# EAGLE schematic lemon-drop (EAGLE 9.6.2)
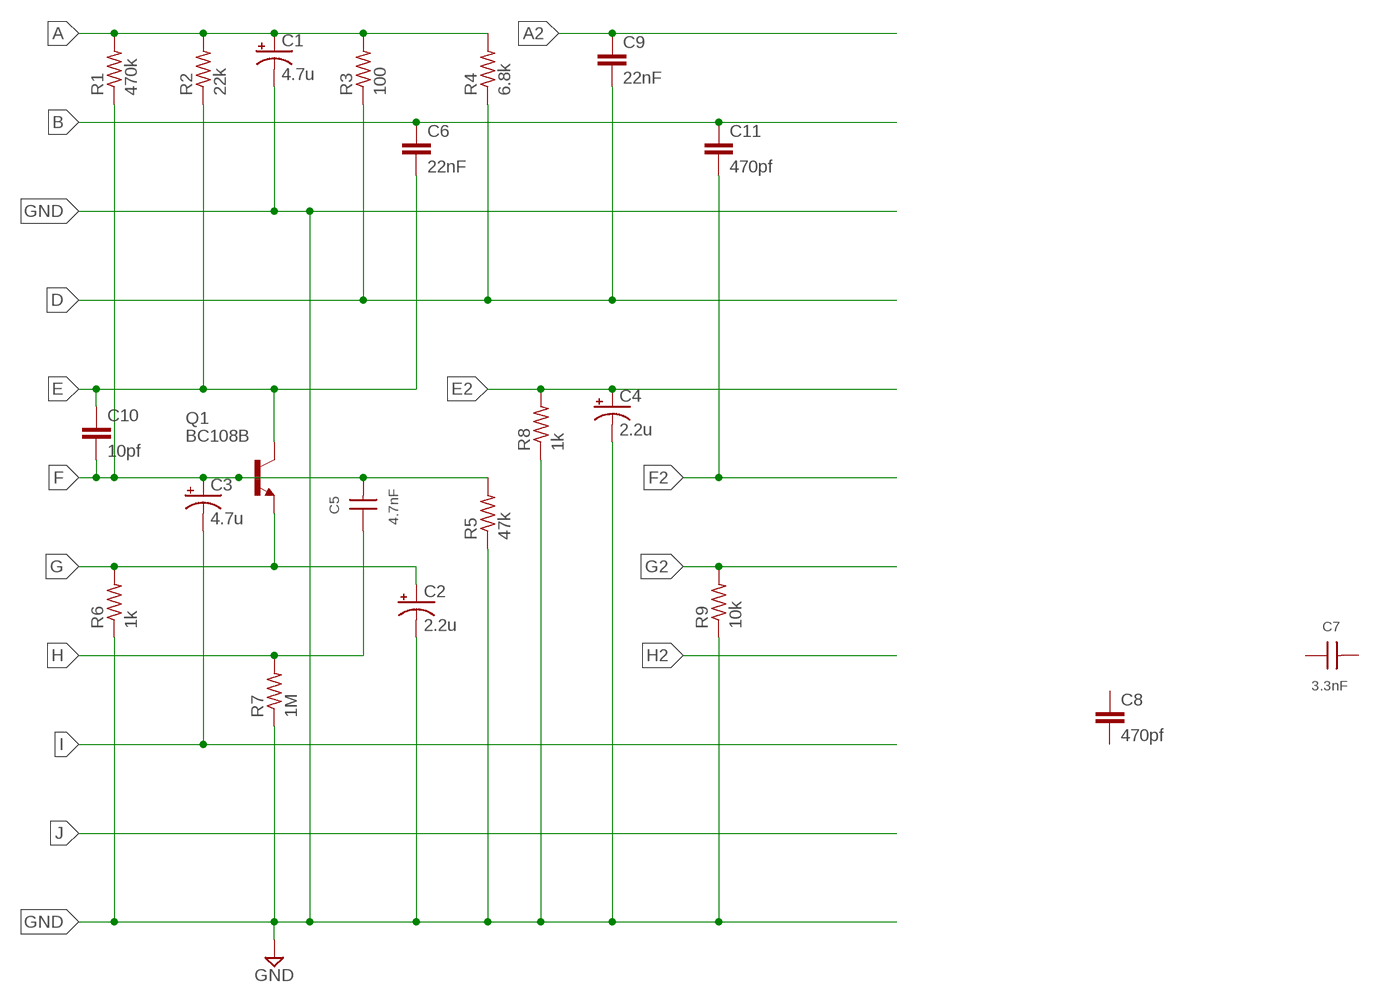
[diagram p0: schematic, sheet 1]

## Parts
C1  4.7u  C-E0.1_0.15  [C-E-0.1_0.15]
C2  2.2u  C-E0.1_0.15  [C-E-0.1_0.15]
C3  4.7u  C-E0.1_0.15  [C-E-0.1_0.15]
C4  2.2u  C-E0.1_0.15  [C-E-0.1_0.15]
C5  4.7nF  C-PP_0.40.2  [C-PP-0.4_0.2]
C6  22nF  C7.5/5  [C7.5B5]
C7  3.3nF  C-PP_0.40.15  [C-PP-0.4_0.15]
C8  470pf  C-CERAMICC-C-0.1_0.05  [C-C-0.1_0.05]
C9  22nF  C7.5/5  [C7.5B5]
C10  10pf  C-CERAMICC-C-0.1_0.05  [C-C-0.1_0.05]
C11  470pf  C-CERAMICC-C-0.1_0.05  [C-C-0.1_0.05]
Q1  BC108B  [TO18]
R1  470k  RESISTOR0204/7  [0204/7]
R2  22k  RESISTOR0204/7  [0204/7]
R3  100  RESISTOR0204/7  [0204/7]
R4  6.8k  RESISTOR0204/7  [0204/7]
R5  47k  RESISTOR0204/7  [0204/7]
R6  1k  RESISTOR0204/7  [0204/7]
R7  1M  RESISTOR0204/7  [0204/7]
R8  1k  RESISTOR0204/7  [0204/7]
R9  10k  RESISTOR0204/7  [0204/7]

## Nets
A: C1.+ R1.2 R2.2 R3.2 R4.2
A2: C9.1
B: C6.1 C11.1
D: C9.2 R3.1 R4.1
E: C6.2 C10.1 Q1.3(C) R2.1
E2: C4.+ R8.2
F: C3.+ C5.2 C10.2 Q1.2(B) R1.1 R5.2
F2: C11.2
G: C2.+ Q1.1(E) R6.2
G2: R9.2
GND: C1.- C2.- C4.- R5.1 R6.1 R7.1 R8.1 R9.1
H: C5.1 R7.2
I: C3.-
Unconnected: C7.1 C7.2 C8.1 C8.2

## Library data of the parts
C1-C4 = pedal-library:C-E: POLARIZED CAPACITOR, American symbol
C5 C7 = pedal-library:C-PP_0.4; PITCH: 0.4in
C6 C9 = capacitor-wima:C: CAPACITOR naming: grid - package width
C8 C10 C11 = pedal-library:C-CERAMIC: CAPACITOR, European symbol; SPICEPREFIX: C
Q1 = transistor-npn:BC108B: NPN Transistor
R1-R9 = pedal-library:RESISTOR: RESISTOR, American symbol; SPICEPREFIX: R